# Altium schematic sheet STC12C5A60S2最小系统.SchDoc
size A4
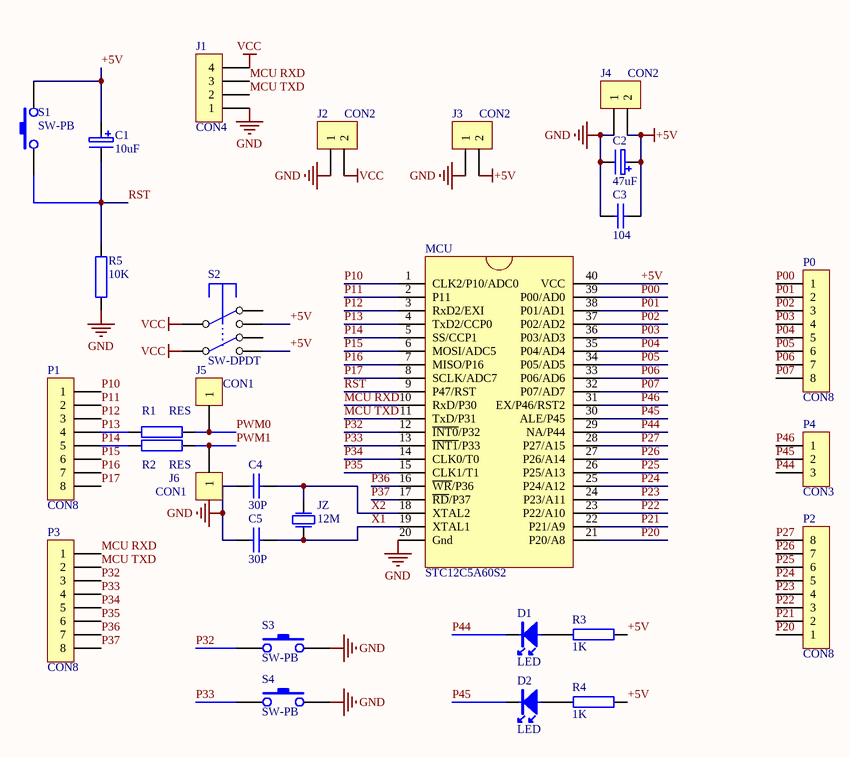
[diagram p0: STC12C5A60S2最小系统.SchDoc]

## Parts
C1  10uF  [CAO1]
C2  47uF  [CAO1]
C3  104  [CAP1]
C4  30P  [CAP1]
C5  30P  [CAP1]
D1  LED  [LED2]
D2  LED  [LED2]
J1  CON4  [sip-4]
J2  CON2  [sip-2]
J3  CON2  [sip-2]
J4  CON2  [sip-2]
J5  CON1  [SIP-1]
J6  CON1  [SIP-1]
JZ  12M  [JZ1]
MCU  STC12C5A60S2  [DIP-40]
P0  CON8  [sip-8]
P1  CON8  [sip-8]
P2  CON8  [sip-8]
P3  CON8  [sip-8]
P4  CON3  [sip-3]
R1  RES  [AXIAL0.3]
R2  RES  [AXIAL0.3]
R3  1K  [AXIAL0.3]
R4  1K  [AXIAL0.3]
R5  10K  [AXIAL0.3]
S1  SW-PB  [SW6*6]
S2  SW-DPDT  [SW3]
S3  SW-PB  [SW6*6]
S4  SW-PB  [SW6*6]

## Nets
+5V: C1.1 C2.1 C3.1 J3.2 J4.2 MCU.40(VCC) R3.2 R4.2 S1.2 S2.1 S2.4
GND: C2.2 C3.2 C4.2 C5.2 J1.1 J2.1 J3.1 J4.1 MCU.20(Gnd) R5.1 S3.2 S4.2
VCC: J1.4 J2.2 S2.2 S2.5
MCU RXD: J1.3 MCU.10(RxD/P30) P3.1
MCU TXD: J1.2 MCU.11(TxD/P31) P3.2
P00: MCU.39(P00/AD0) P0.1
P01: MCU.38(P01/AD1) P0.2
P02: MCU.37(P02/AD2) P0.3
P03: MCU.36(P03/AD3) P0.4
P04: MCU.35(P04/AD4) P0.5
P05: MCU.34(P05/AD5) P0.6
P06: MCU.33(P06/AD6) P0.7
P07: MCU.32(P07/AD7) P0.8
P10: MCU.1(CLK2/P10/ADC0) P1.1
P11: MCU.2(P11) P1.2
P12: MCU.3(RxD2/EXI) P1.3
P13: MCU.4(TxD2/CCP0) P1.4 R1.1
P14: MCU.5(SS/CCP1) P1.5 R2.1
P15: MCU.6(MOSI/ADC5) P1.6
P16: MCU.7(MISO/P16) P1.7
P17: MCU.8(SCLK/ADC7) P1.8
P20: MCU.21(P20/A8) P2.1
P21: MCU.22(P21/A9) P2.2
P22: MCU.23(P22/A10) P2.3
P23: MCU.24(P23/A11) P2.4
P24: MCU.25(P24/A12) P2.5
P25: MCU.26(P25/A13) P2.6
P26: MCU.27(P26/A14) P2.7
P27: MCU.28(P27/A15) P2.8
P32: MCU.12(~{INT0}/P32) P3.3 S3.1
P33: MCU.13(~{INT1}/P33) P3.4 S4.1
P34: MCU.14(CLK0/T0) P3.5
P35: MCU.15(CLK1/T1) P3.6
P36: MCU.16(~{WR}/P36) P3.7
P37: MCU.17(~{RD}/P37) P3.8
P44: D1.2 MCU.29(NA/P44) P4.3
P45: D2.2 MCU.30(ALE/P45) P4.2
P46: MCU.31(EX/P46/RST2) P4.1
PWM0: J5.1 R1.2
PWM1: J6.1 R2.2
RST: C1.2 MCU.9(P47/RST) R5.2 S1.1
X1: C5.1 JZ.2(P2) MCU.19(XTAL1)
X2: C4.1 JZ.1(P1) MCU.18(XTAL2)
NetD1_1: D1.1 R3.1
NetD2_1: D2.1 R4.1

Not connected (* = marked no-connect by the designer): S2 0 3

## Library data of the parts
C1 C2 = CAP3
C3-C5 = CAP1
J1 = CON4: Connector
J2-J4 = CON2: Connector
J5 J6 = CON1: Connector
JZ = CRY1: 6.0000 8.000  11.0592  12.0000 24.000
MCU = STC12C5AXXS2
P0-P3 = CON8: Connector
P4 = CON3: Connector
R3-R5 = RES